# EAGLE design servo-pulsadores (EAGLE 7.2.0)
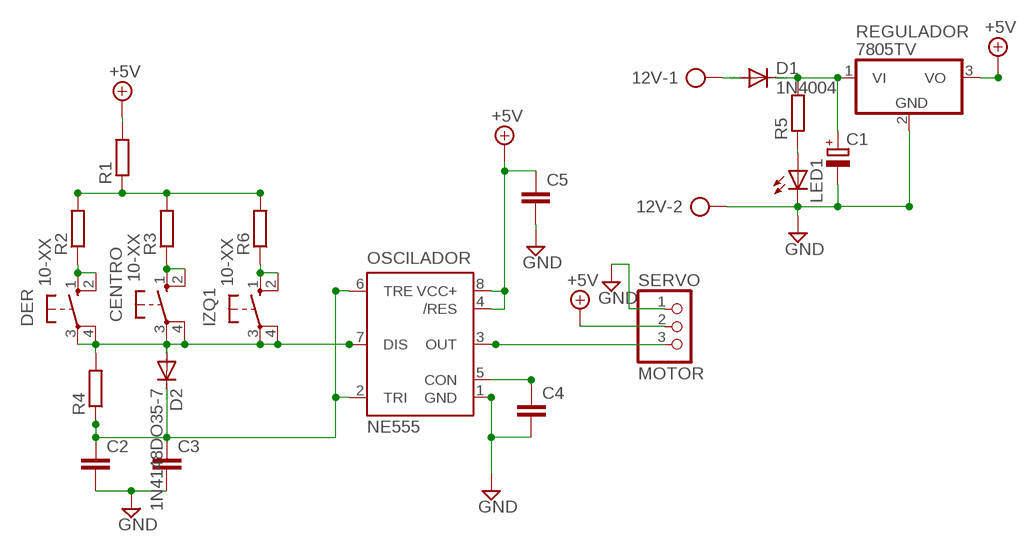
[diagram p0: schematic, sheet 1]

## Parts
12V  AK500/2  [AK500/2]
C1  CPOL-EUE2.5-7  [E2,5-7]
C2  C-EU025-025X050  [C025-025X050]
C3  C-EU025-025X050  [C025-025X050]
C4  C-EU025-025X050  [C025-025X050]
C5  C-EU050-025X075  [C050-025X075]
CENTRO  10-XX  [B3F-10XX]
D1  1N4004  [DO41-10]
D2  1N4148DO35-7  [DO35-7]
DER  10-XX  [B3F-10XX]
IZQ1  10-XX  [B3F-10XX]
LED1  LED3MM  [LED3MM]
OSCILADOR  NE555  [DIL-08]
R1  R-EU_0207/7  [0207/7]
R2  R-EU_0207/7  [0207/7]
R3  R-EU_0207/7  [0207/7]
R4  R-EU_0207/7  [0207/7]
R5  R-EU_0207/7  [0207/7]
R6  R-EU_0207/7  [0207/7]
REGULADOR  7805TV  [TO220V]
SERVO  MOTOR  PINHD-1X3  [1X03]

## Nets
+5V: C5.1 OSCILADOR.4(/RES) OSCILADOR.8(VCC+) R1.2 REGULADOR.3(VO) SERVO.2
GND: 12V.2 C1.- C2.2 C3.2 C4.2 C5.2 LED1.K(C) OSCILADOR.1(GND) REGULADOR.2(GND) SERVO.1
N$1: LED1.A R5.1
N$2: DER.1(S) DER.2(S1) R2.1
N$3: OSCILADOR.3(OUT) SERVO.3
N$4: CENTRO.1(S) CENTRO.2(S1) R3.1
N$5: R1.1 R2.2 R3.2 R6.2
N$6: C4.1 OSCILADOR.5(CON)
N$7: C2.1 C3.1 D2.C OSCILADOR.2(TRI) OSCILADOR.6(TRE) R4.1
N$8: IZQ1.1(S) IZQ1.2(S1) R6.1
N$11: CENTRO.3(P) CENTRO.4(P1) D2.A DER.3(P) DER.4(P1) IZQ1.3(P) IZQ1.4(P1) OSCILADOR.7(DIS) R4.2
N$12: C1.+ D1.C R5.2 REGULADOR.1(VI)
N$13: 12V.1 D1.A

## Library data of the parts
12V = con-ptr500:AK500/2: CONNECTOR; OC_FARNELL: unknown; OC_NEWARK: unknown
C1 = rcl:CPOL-EU: POLARIZED CAPACITOR, European symbol
C2-C5 = rcl:C-EU: CAPACITOR, European symbol
CENTRO DER IZQ1 = switch-omron:10-XX: OMRON SWITCH; MPN: B3F-1000; OC_FARNELL: 176432; OC_NEWARK: 36M3542
D1 = diode:1N4004: DIODE general purpose rectifier, 1 A
D2 = diode:1N4148: DIODE high speed (Philips)
LED1 = led:LED: LED OSRAM: - CHIPLED LG R971, LG N971, LY N971, LG Q971, LY Q971, LO R971, LY R971 LH N974, LH R974 LS Q976, LO Q976, LY Q976 LO Q996 - Hyper CHIPLED LW Q18S LB Q993, LB Q99A, LB R99A - SideLED LS A670, LO A670, LY A670, LG A670, LP A670 LB A673, LV A673, LT A673, LW A673 LH A674 LY A675 LS A676, LA A676, LO A676, LY A676, LW A676 LS A679, LY A679, LG A679 - Hyper Micro SIDELED® LS Y876, LA Y876, LO Y876, LY Y876 LT Y87S - SmartLED LW L88C, LW L88S LB L89C, LB L89S, LG L890 LS L89K, LO L89K, LY L89K LS L896, LA L896, LO L896, LY L896 - TOPLED LS T670, LO T670, LY T670, LG T670, LP T670 LSG T670, LSP T670, LSY T670, LOP T670, LYG T670 LG T671, LOG T671, LSG T671 LB T673, LV T673, LT T673, LW T673 LH T674 LS T676, LA T676, LO T676, LY T676, LB T676, LH T676, LSB T676, LW T676 LB T67C, LV T67C, LT T67C, LS T67K, LO T67K, LY T67K, LW E67C LS E67B, LA E67B, LO E67B, LY E67B, LB E67C, LV E67C, LT E67C LW T67C LS T679, LY T679, LG T679 LS T770, LO T770, LY T770, LG T770, LP T770 LB T773, LV T773, LT T773, LW T773 LH T774 LS E675, LA E675, LY E675, LS T675 LS T776, LA T776, LO T776, LY T776, LB T776 LHGB T686 LT T68C, LB T68C - Hyper Mini TOPLED® LB M676 - Mini TOPLED Santana® LG M470 LS M47K, LO M47K, LY M47K Source: http://www.osram.convergy.de LUXEON: - LUMILED® LXK2-PW12-R00, LXK2-PW12-S00, LXK2-PW14-U00, LXK2-PW14-V00 LXK2-PM12-R00, LXK2-PM12-S00, LXK2-PM14-U00 LXK2-PE12-Q00, LXK2-PE12-R00, LXK2-PE12-S00, LXK2-PE14-T00, LXK2-PE14-U00 LXK2-PB12-K00, LXK2-PB12-L00, LXK2-PB12-M00, LXK2-PB14-N00, LXK2-PB14-P00, LXK2-PB14-Q00 LXK2-PR12-L00, LXK2-PR12-M00, LXK2-PR14-Q00, LXK2-PR14-R00 LXK2-PD12-Q00, LXK2-PD12-R00, LXK2-PD12-S00 LXK2-PH12-R00, LXK2-PH12-S00 LXK2-PL12-P00, LXK2-PL12-Q00, LXK2-PL12-R00 Source: www.luxeon.com KINGBRIGHT: KA-3528ASYC Source: www.kingbright.com
OSCILADOR = st-microelectronics:NE555: General purpose bipolar Timer; MF: Arrow Electronics; MPN: NE555N; OC_FARNELL: 1467742; OC_NEWARK: 89K1486
R1-R6 = resistor:R-EU_: RESISTOR, European symbol
REGULADOR = linear:78*: Positive VOLTAGE REGULATOR Source: http://cache.national.com/ds/LM/LM78L05.pdf http://www.fairchildsemi.com/ds/LM/LM7805.pdf
SERVO = pinhead:PINHD-1X3: PIN HEADER

## Board
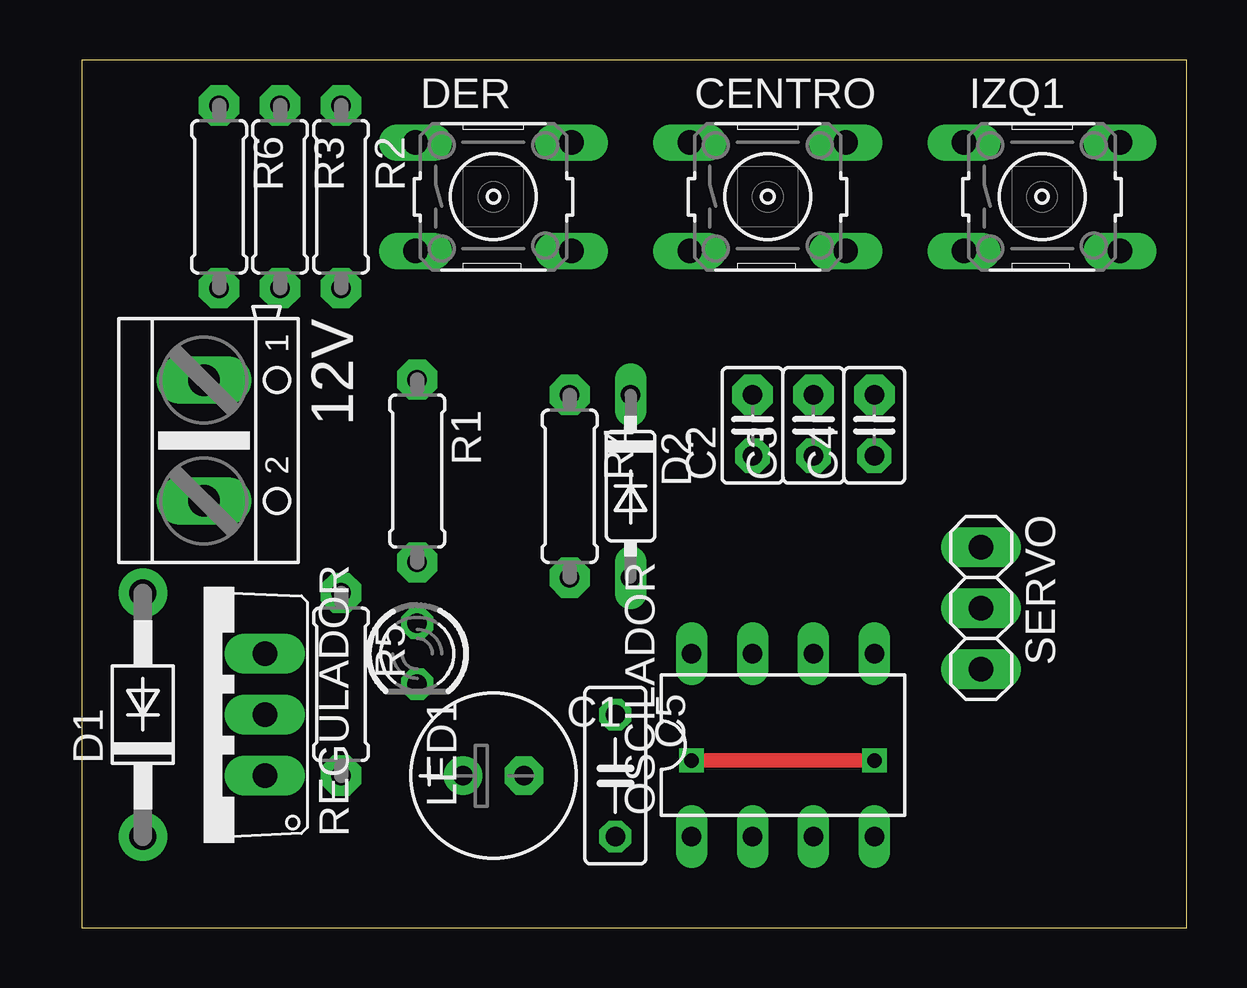
[diagram p1: board, top side]
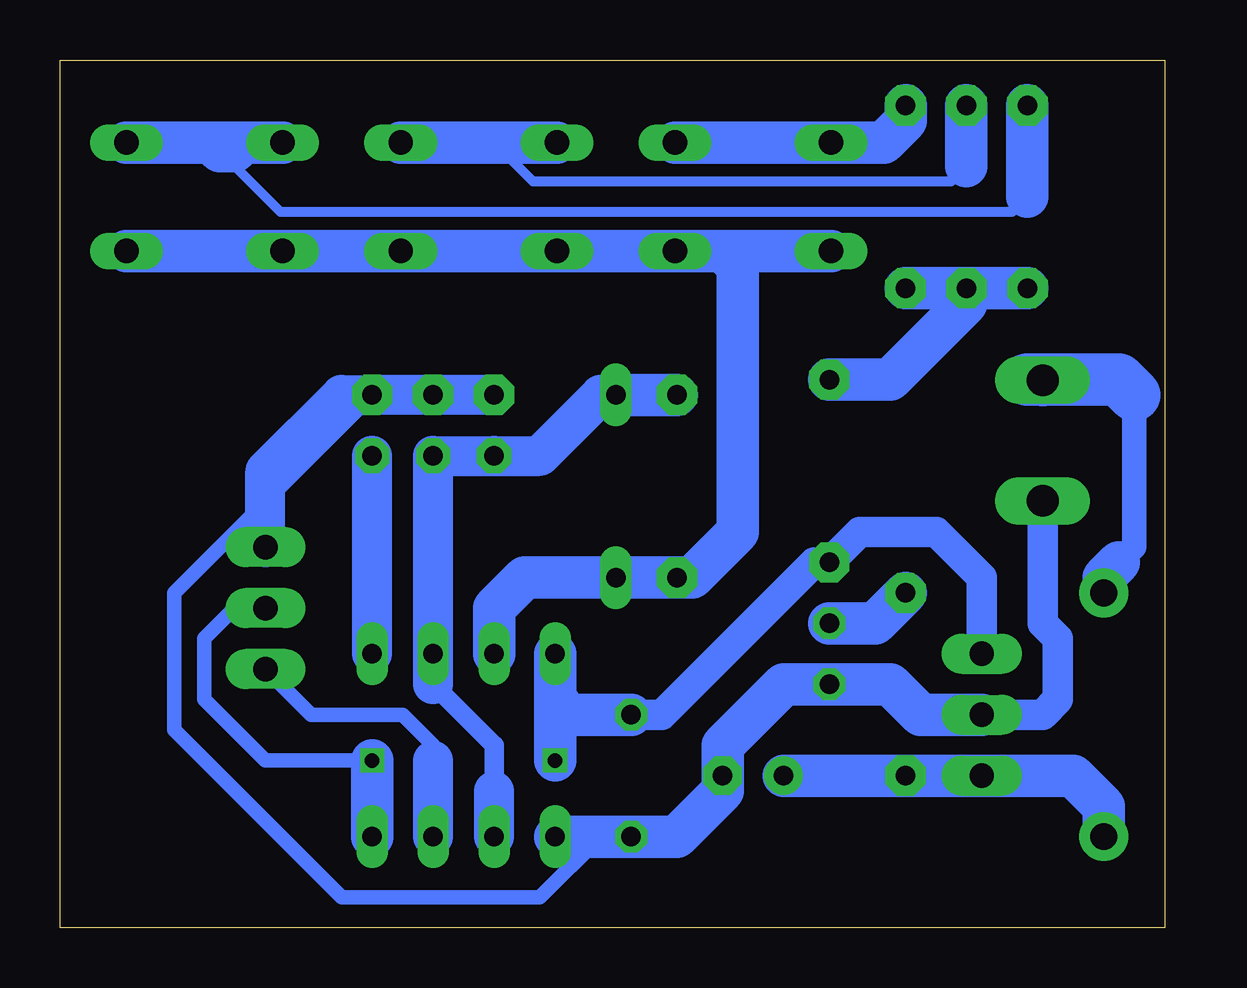
[diagram p2: board, bottom side, seen from below]

Size 46.02 x 36.19 mm. Coordinates in mm from the lower left corner, seen from the top.
Outline: 0,0 46.02,0 46.02,36.19 0,36.19 0,0
Copper layers (1*16): Top 0.035mm / dielectric 1.5mm / Bottom 0.035mm
Design rules "default": minimum track width 10mil, minimum drill 24mil, track to track 8mil, track to pad 8mil, pad to pad 8mil, via to via 8mil, smd to smd 8mil, copper to edge 40mil, drill to drill 8mil, minimum pad ring 10mil, minimum via ring 8mil, stop-mask expansion 4mil, vias tented up to drill 0mil, thermal gap 10mil

### Footprints (pad centres in the part's own frame; a part is rotated, then mirrored left to right if it is on the bottom)
AK500/2 = drill 1.321 long: 1 -2.515,0; 2 2.515,0
E2,5-7 = drill 0.813 pad 1.6: + -1.27,0 | drill 0.813 pad 1.6 octagon: - 1.27,0
C025-025X050 = drill 0.813 pad 1.422 octagon: 1 -1.27,0 | drill 0.813 pad 1.676 octagon: 2 1.27,0
C050-025X075 = drill 0.813 octagon: 1 -2.54,0; 2 2.54,0
B3F-10XX = drill 1.016 long: 1 -3.251,2.261; 2 3.251,2.261; 3 -3.251,-2.261; 4 3.251,-2.261
DO41-10 = drill 1.118 pad 2.032: A 5.08,0; C -5.08,0
DO35-7 = drill 0.813 long: A 3.81,0; C -3.81,0
LED3MM = drill 0.813 octagon: A -1.27,0; K 1.27,0
DIL-08 = drill 0.813 long: 1 -3.81,-3.81; 2 -1.27,-3.81; 3 1.27,-3.81; 4 3.81,-3.81; 5 3.81,3.81; 6 1.27,3.81; 7 -1.27,3.81; 8 -3.81,3.81
0207/7 = drill 0.813 pad 1.676 octagon: 1 -3.81,0; 2 3.81,0
TO220V = drill 1.016 pad 1.676 long: 1 -2.54,-2.54; 2 0,-2.54; 3 2.54,-2.54
1X03 = drill 1.016 pad 1.676 long: 1 -2.54,0; 2 0,0; 3 2.54,0

### Placement (x,y rotation side)
12V  5.08,20.32 270 top
C1  17.14,6.35 0 top
C2  27.94,20.96 90 top
C3  30.48,20.96 90 top
C4  33.02,20.96 90 top
C5  22.23,6.35 270 top
CENTRO  28.57,30.48 0 top
D1  2.54,8.89 90 top
D2  22.86,18.41 270 top
DER  17.14,30.48 0 top
IZQ1  40.01,30.48 0 top
LED1  13.97,11.43 270 top
OSCILADOR  29.21,7.62 0 top
R1  13.97,19.05 270 top
R2  10.8,30.48 270 top
R3  8.26,30.48 270 top
R4  20.32,18.41 270 top
R5  10.8,10.16 270 top
R6  5.71,30.48 270 top
REGULADOR  5.08,8.89 90 top
SERVO  37.46,13.34 270 top

### Tracks (layer width: path | path; a pad name or v marks a point on that pad's centre or on a via)
+5V  (via drill 0.6)
  Top 0.61: v33.02,6.99 v25.4,6.99
  Bottom 0.61: v33.02,6.99 37.46,6.99 40.01,9.53 40.01,12.07 38.73,13.34 SERVO.2
  Bottom 1.27: REGULADOR.3 7.62,14.61 9.52,16.51 12.7,16.51 R1.2 14.6,15.24 20.95,8.89 C5.1
  Bottom 1.778: C5.1 24.77,8.89 25.4,9.53 OSCILADOR.8 v25.4,6.99 | OSCILADOR.4 v33.02,6.99
GND
  Bottom 0.61: C2.2 C4.2 41.27,13.97 41.27,8.25 34.29,1.27 26.03,1.27 23.49,3.81
  Bottom 1.27: REGULADOR.2 5.08,8.89 4.45,9.53 4.45,12.07 5.08,12.7 12V.2
  Bottom 1.676: C2.2 C3.2 C4.2 34.29,22.23 37.46,19.05 SERVO.1
  Bottom 1.778: REGULADOR.2 10.16,8.89 11.43,10.16 LED1.K 15.88,10.16 18.41,7.62 C1.- 18.41,5.71 20.32,3.81 C5.2 23.49,3.81 OSCILADOR.1
N$1
  Bottom 1.778: LED1.A 12.06,12.7 R5.1
N$2
  Bottom 1.778: DER.2 DER.1 11.71,32.74 10.8,33.66 R2.1
N$3
  Bottom 0.61: 30.48,6.99 30.48,7.62 31.75,8.89 35.56,8.89 SERVO.3
  Bottom 1.676: OSCILADOR.3 30.48,6.99
N$4
  Bottom 0.406: 8.26,31.75 8.89,31.12 26.31,31.12 27.94,32.74
  Bottom 1.778: CENTRO.2 27.94,32.74 CENTRO.1 | R3.1 8.26,31.75
N$5
  Bottom 1.778: R6.2 R3.2 | R3.2 R2.2 | R3.2 8.26,26.04 11.43,22.86 R1.1
N$6
  Bottom 1.676: OSCILADOR.5 C4.1
N$7
  Bottom 0.813: 27.94,5.71 27.94,7.62 30.48,10.16
  Bottom 1.676: OSCILADOR.2 27.94,5.71 | 30.48,10.16 OSCILADOR.6 C3.1 C2.1 26.03,19.69 23.49,22.23 D2.C
  Bottom 1.778: R4.1 D2.C
N$8
  Bottom 0.406: 5.71,30.48 6.35,29.84 36.83,29.84 39.69,32.7 40.01,33.02
  Bottom 1.778: R6.1 5.71,30.48 | IZQ1.2 IZQ1.1 38.38,32.74 38.73,32.38 39.37,32.38 39.69,32.7
N$11
  Bottom 1.778: DER.3 18.41,28.22 | 18.41,28.22 DER.4 CENTRO.3 CENTRO.4 IZQ1.3 IZQ1.4 | 18.41,28.22 17.78,27.58 17.78,16.51 19.69,14.61 R4.2 D2.A 26.67,14.61 27.94,13.34 OSCILADOR.7
N$12
  Bottom 1.778: D1.C 2.54,5.08 3.81,6.35 REGULADOR.1 R5.2 C1.+
N$13
  Bottom 1.016: 1.9,15.24 1.27,15.88 1.27,22.23
  Bottom 1.778: D1.A 2.54,14.61 1.9,15.24
  Bottom 2.184: 1.27,22.23 1.9,22.86 5.1,22.86 | 5.71,22.86 5.1,22.86 | 5.1,22.86 12V.1